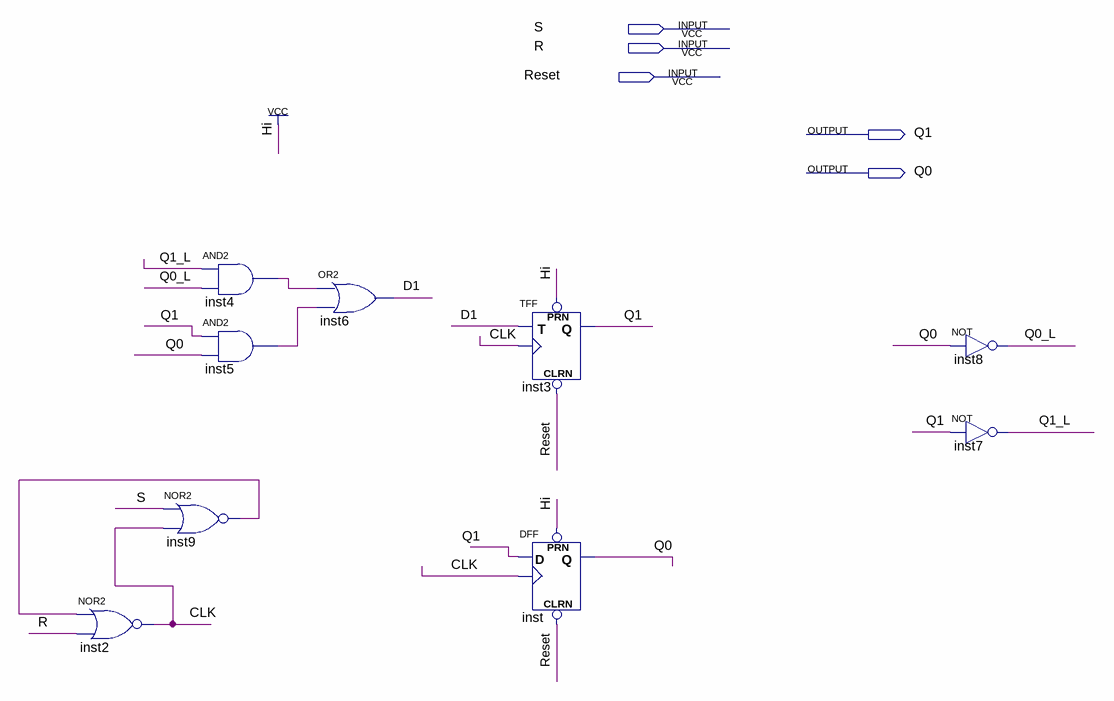
[diagram p0: schematic sheet]
// Quartus schematic Lab3_Quiz.bdf as structural Verilog: 9 symbols, 5 pins
module Lab3_Quiz (
  input  S,
  input  R,
  input  Reset,
  output Q1,
  output Q0
);

  wire CLK, D1, inst4_out, inst5_out, inst9_out, Q0_L, Q1_L;

  nor inst2 (CLK, inst9_out, R);
  and inst4 (inst4_out, Q1_L, Q0_L);
  and inst5 (inst5_out, Q1, Q0);
  nor inst9 (inst9_out, S, CLK);
  or inst6 (D1, inst4_out, inst5_out);
  TFF inst3 (.PRN(1'b1), .CLRN(Reset), .T(D1), .CLK(CLK), .Q(Q1));
  DFF inst (.CLRN(Reset), .CLK(CLK), .D(Q1), .PRN(1'b1), .Q(Q0));
  not inst8 (Q0_L, Q0);
  not inst7 (Q1_L, Q1);
endmodule
